# EAGLE design untitled (EAGLE 9.5.2)
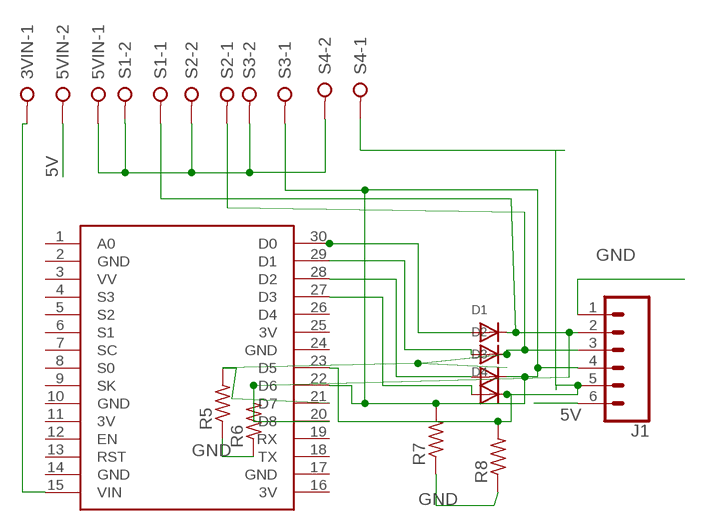
[diagram p0: schematic, sheet 1]

## Parts
3VIN  W237-02P  [W237-132]
5VIN  W237-02P  [W237-132]
D1  DIODEDO-1N4148  [DO-1N4148]
D2  DIODEDO-1N4148  [DO-1N4148]
D3  DIODEDO-1N4148  [DO-1N4148]
D4  DIODEDO-1N4148  [DO-1N4148]
J1  CONN_06LONGPADS  [1X06_LONGPADS]
R5  R-US_0204/7  [0204/7]
R6  R-US_0204/7  [0204/7]
R7  R-US_0204/7  [0204/7]
R8  R-US_0204/7  [0204/7]
S1  W237-02P  [W237-132]
S2  W237-02P  [W237-132]
S3  W237-02P  [W237-132]
S4  W237-02P  [W237-132]
U$1  NODEMCU  [NODEMCU]

## Nets
5V: 5VIN.2 J1.6
GND: J1.1 R5.1 R6.1 R7.1 R8.1
N$1: D1.A U$1.30(D0)
N$2: D2.A U$1.29(D1)
N$3: D3.A U$1.28(D2)
N$4: D4.A U$1.27(D3)
N$5: 5VIN.1 S1.2 S2.2 S3.2 S4.2
N$6: 3VIN.1 U$1.15(VIN)
N$7: D2.C J1.3 R5.2 S2.1 U$1.21(D7)
N$8: D1.C J1.2 R6.2 S1.1 U$1.20(D8)
N$9: D4.C J1.5 R8.2 S4.1 U$1.23(D5)
N$10: D3.C J1.4 R7.2 S3.1 U$1.22(D6)
Unconnected: 3VIN.2 U$1.1(A0) U$1.3(VV) U$1.4(S3) U$1.5(S2) U$1.6(S1) U$1.7(SC) U$1.8(S0) U$1.9(SK) U$1.12(EN) U$1.13(RST) U$1.18(TX) U$1.19(RX) U$1.26(D4)

## Power pins joined to a net without a drawn wire
3V: U$1.11(3V) U$1.16(3V) U$1.25(3V)
GND: U$1.2(GND) U$1.10(GND) U$1.14(GND) U$1.17(GND) U$1.24(GND)

## Library data of the parts
3VIN 5VIN S1-S4 = con-wago-508:W237-02P: WAGO SREW CLAMP; OC_FARNELL: unknown; OC_NEWARK: unknown
D1-D4 = adafruit:DIODE: Diode SMADIODE - SMA Surface Mount Package 20V 1A Schottky Diode Digikey: 641-1014-6-ND DO-1N4148 - Through Hole Small Current Diode SOD-123 20V 1 A (.5mV Vf) Schottky Diode - Digikey: MBRX120TPMSCT-ND SOD-323 10V 570mA (.38mV Vf, 3ns) Schottky Diode - Digikey: ZLLS410CT-ND SOD-523 30V 30mA Schottky Diode (RB751S-40TE61) - Digikey: RB751S-40TE61CT-ND SOT23-R/W - SOT23 Package (R = Solder Paste/Reflow Ovens, W = Hand-Soldering) BAT54Film 40V 300mA - Digikey: 497-7162-1-ND
J1 = SparkFun-Connectors:CONN_06: Multi connection point. Often used as Generic Header-pin footprint for 0.1 inch spaced/style header connections On any of the 0.1 inch spaced packages, you can populate with these: Break Away Headers - Straight <https://www.sparkfun.com/products/116> (PRT-00116) Break Away Male Headers - Right Angle <https://www.sparkfun.com/products/553> (PRT-00553) Female Headers <https://www.sparkfun.com/products/115> (PRT-00115) Break Away Headers - Machine Pin <https://www.sparkfun.com/products/117> (PRT-00117) Break Away Female Headers - Swiss Machine Pin <https://www.sparkfun.com/products/743> (PRT-00743) Arduino Stackable Header - 6 Pin <https://www.sparkfun.com/products/9280> (PRT-09280) For SCREWTERMINALS and SPRING TERMINALS visit here: Screw Terimnals on SparkFun.com <https://www.sparkfun.com/search/results?term=Screw+Terminals> (5mm/3.5mm/2.54mm spacing) This device is also useful as a general connection point to wire up your design to another part of your project. Our various solder wires solder well into these plated through hole pads. Hook-Up Wire - Assortment (Stranded, 22 AWG) <https://www.sparkfun.com/products/11375> (PRT-11375) Hook-Up Wire - Assortment (Solid Core, 22 AWG) <https://www.sparkfun.com/products/11367> (PRT-11367) View the entire wire category on our website here <https://www.sparkfun.com/categories/141>
R5-R8 = adafruit:R-US_: RESISTOR, American symbol
U$1 = nodemcu:NODEMCU

## Board
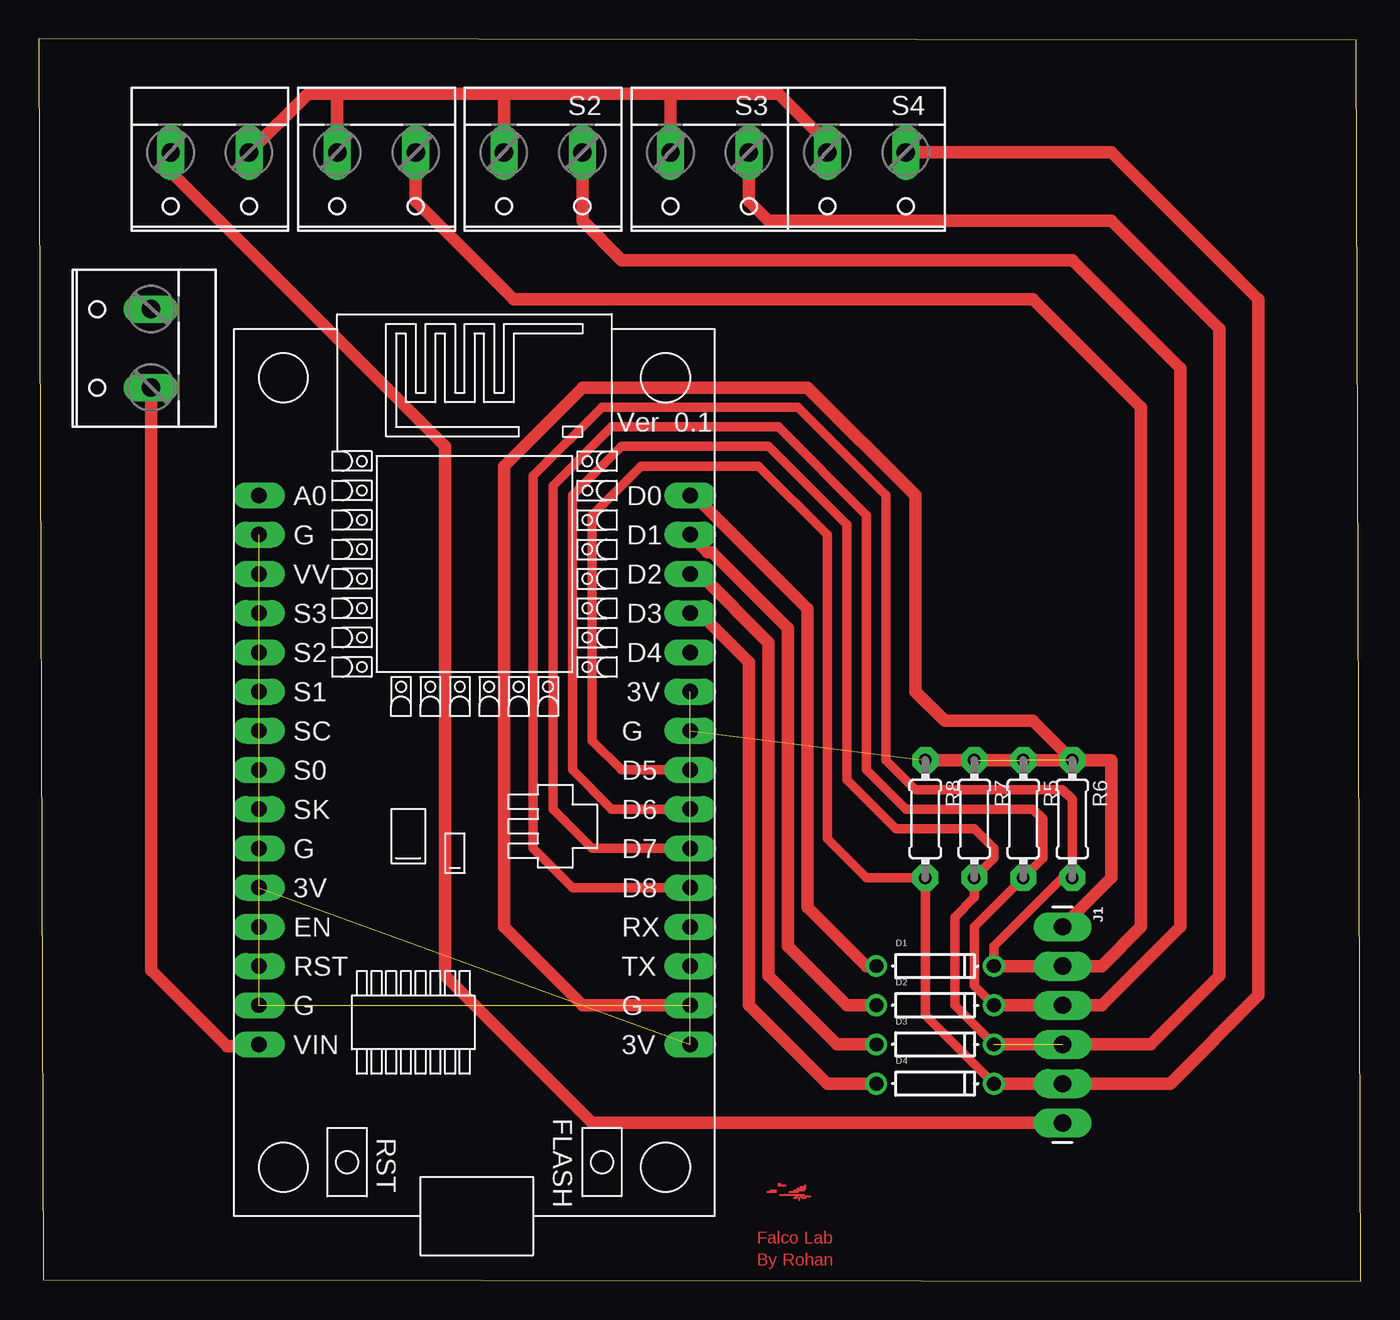
[diagram p1: board, top side]

Size 85.68 x 80.49 mm. Coordinates in mm from the lower left corner, seen from the top.
Outline: 0.3,0.1 85.68,0 85.37,80.39 0,80.49 0.3,0.1
Copper layers (1*16): Top 0.035mm / dielectric 1.5mm / Bottom 0.035mm
Design rules "default": minimum track width 6mil, minimum drill 0.35mm, track to track 6mil, track to pad 6mil, pad to pad 6mil, via to via 6mil, smd to smd 6mil, copper to edge 40mil, drill to drill 6mil, minimum pad ring 10mil, minimum via ring 8mil, stop-mask expansion 4mil, vias tented up to drill 0mil, thermal gap 10mil

### Footprints (pad centres in the part's own frame; a part is rotated, then mirrored left to right if it is on the bottom)
W237-132 = drill 1.194 long: 1 -2.54,-0.635; 2 2.54,-0.635
DO-1N4148 = drill 0.9: A -3.81,0; C 3.81,0
1X06_LONGPADS = drill 1.118 pad 1.88 long: 1 0,0; 2 2.54,0; 3 5.08,0; 4 7.62,0; 5 10.16,0; 6 12.7,0
0204/7 = drill 0.813 pad 1.676 octagon: 1 -3.81,0; 2 3.81,0
NODEMCU = drill 1 pad 1.676 long: 1 -13.97,17.78; 2 -13.97,15.24; 3 -13.97,12.7; 4 -13.97,10.16; 5 -13.97,7.62; 6 -13.97,5.08; 7 -13.97,2.54; 8 -13.97,0; 9 -13.97,-2.54; 10 -13.97,-5.08; 11 -13.97,-7.62; 12 -13.97,-10.16; 13 -13.97,-12.7; 14 -13.97,-15.24; 15 -13.97,-17.78; 16 13.97,-17.78; 17 13.97,-15.24; 18 13.97,-12.7; 19 13.97,-10.16; 20 13.97,-7.62; 21 13.97,-5.08; 22 13.97,-2.54; 23 13.97,0; 24 13.97,2.54; 25 13.97,5.08; 26 13.97,7.62; 27 13.97,10.16; 28 13.97,12.7; 29 13.97,15.24; 30 13.97,17.78

### Placement (x,y rotation side)
3VIN  6.65,60.43 90 top
5VIN  11.1,72.49 180 top
D1  58.09,20.42 0 top
D2  58.09,17.88 0 top
D3  58.09,15.34 0 top
D4  58.09,12.8 0 top
J1  66.34,22.96 270 top
R5  63.8,29.95 270 top
R6  66.98,29.95 270 top
R7  60.63,29.95 270 top
R8  57.45,29.95 270 top
S1  21.89,72.49 180 top
S2  32.69,72.49 180 top
S3  43.48,72.49 180 top
S4  53.64,72.49 180 top
U$1  28.24,33.12 0 top

### Tracks (layer width: path | path; a pad name or v marks a point on that pad's centre or on a via)
3V  (2 unrouted)
5V
  Top 0.813: 5VIN.2 8.56,71.86 26.34,54.08 26.34,19.79 35.86,10.26 J1.6
GND  (6 unrouted)
  Top 0.813: J1.1 69.52,26.14 69.52,33.76 R6.1 | R8.1 R6.1 | R6.1 64.44,36.3 58.72,36.3 56.82,38.2 56.82,50.9 49.83,57.89 35.23,57.89 30.15,52.81 30.15,22.96 35.23,17.88 U$1.17
N$1
  Top 0.813: U$1.30 42.35,51.04 49.83,43.56 49.83,24.23 53.64,20.42 D1.A
N$2
  Top 0.813: U$1.29 43.36,47.22 43.63,47.22 48.56,42.29 48.56,21.69 52.37,17.88 D2.A
N$3
  Top 0.813: U$1.28 42.85,45.82 47.29,41.38 47.29,19.79 51.74,15.34 D3.A
N$4
  Top 0.813: U$1.27 42.85,43.28 46.02,40.11 46.02,17.88 51.1,12.8 D4.A
N$5
  Top 0.813: 5VIN.1 17.45,76.94 19.35,76.94 | 19.35,76.94 30.15,76.94 | 30.15,76.94 40.94,76.94 | 40.94,76.94 47.93,76.94 51.1,73.76 S4.2 | S3.2 40.94,76.94 | S2.2 30.15,76.94 | S1.2 19.35,76.94
N$6
  Top 0.813: U$1.15 14.15,15.21 12.22,15.21 7.29,20.15 3VIN.1
N$7
  Top 0.61: D2.C 60.63,19.15 60.63,22.96 R5.2 65.07,27.41 65.07,29.95 64.44,30.58 56.18,30.58 53.64,33.12 53.64,49.63 47.93,55.35 37.13,55.35 33.32,51.54 33.32,30.58 35.86,28.04 U$1.21
  Top 0.813: D2.C J1.3 68.88,17.88 73.96,22.96 73.96,59.16 66.98,66.14 37.77,66.14 35.23,68.68 S2.1
N$8
  Top 0.61: D1.C 61.9,21.69 66.34,26.14 R6.2 66.98,31.22 66.34,31.85 56.82,31.85 54.91,33.76 54.91,50.9 49.2,56.62 36.5,56.62 32.05,52.17 32.05,28.04 34.59,25.5 U$1.20
  Top 0.813: D1.C J1.2 68.88,20.42 71.42,22.96 71.42,56.62 64.44,63.6 30.78,63.6 24.43,69.95 S1.1
N$9
  Top 0.61: D4.C 57.45,17.25 R8.2 53.64,26.14 51.1,28.68 51.1,48.36 46.66,52.81 39.04,52.81 35.86,49.63 35.86,35.03 37.77,33.12 U$1.23
  Top 0.813: D4.C J1.5 73.33,12.8 79.04,18.52 79.04,63.6 69.52,73.13 S4.1
N$10  (1 unrouted)
  Top 0.61: D3.C 59.36,17.88 59.36,23.6 60.63,24.87 R7.2 61.9,27.41 61.9,28.04 60.63,29.31 55.55,29.31 52.37,32.49 52.37,49 47.29,54.08 37.77,54.08 34.59,50.9 34.59,33.12 37.13,30.58 U$1.22
  Top 0.813: S3.1 46.02,69.95 47.29,68.68 69.52,68.68 76.5,61.7 76.5,19.79 72.06,15.34 D3.C
(copper drawn outside any net)
  shapes: Route2 area x14, Route3 area x47, Route4 area x52, Route5 area x70, Route6 area x110, Top area x17

### Text on the board
Top: Falco Lab | By Rohan